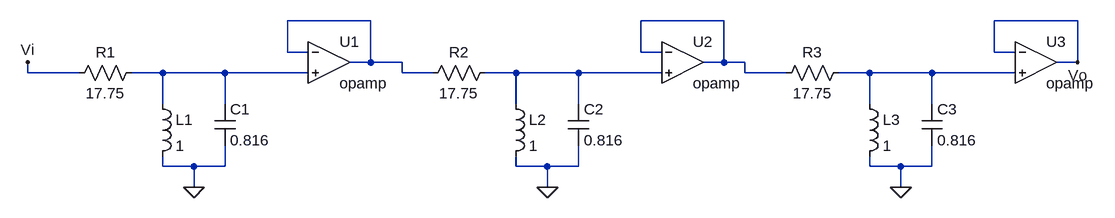
[diagram p0: schematic TS6.asc]
TS6.asc, the LTspice schematic file:
Version 4
SHEET 1 1540 680
WIRE 416 16 288 16
WIRE 960 16 832 16
WIRE 1504 16 1376 16
WIRE 288 64 288 16
WIRE 320 64 288 64
WIRE 832 64 832 16
WIRE 864 64 832 64
WIRE 1376 64 1376 16
WIRE 1408 64 1376 64
WIRE 416 80 416 16
WIRE 416 80 384 80
WIRE 464 80 416 80
WIRE 960 80 960 16
WIRE 960 80 928 80
WIRE 992 80 960 80
WIRE 1504 80 1504 16
WIRE 1504 80 1472 80
WIRE -112 96 -112 80
WIRE -32 96 -112 96
WIRE 96 96 48 96
WIRE 192 96 96 96
WIRE 320 96 192 96
WIRE 464 96 464 80
WIRE 512 96 464 96
WIRE 640 96 592 96
WIRE 736 96 640 96
WIRE 864 96 736 96
WIRE 992 96 992 80
WIRE 1056 96 992 96
WIRE 1184 96 1136 96
WIRE 1280 96 1184 96
WIRE 1408 96 1280 96
WIRE 96 144 96 96
WIRE 192 144 192 96
WIRE 640 144 640 96
WIRE 736 144 736 96
WIRE 1184 144 1184 96
WIRE 1280 144 1280 96
WIRE 96 240 96 224
WIRE 144 240 96 240
WIRE 192 240 192 208
WIRE 192 240 144 240
WIRE 640 240 640 224
WIRE 688 240 640 240
WIRE 736 240 736 208
WIRE 736 240 688 240
WIRE 1184 240 1184 224
WIRE 1232 240 1184 240
WIRE 1280 240 1280 208
WIRE 1280 240 1232 240
WIRE 144 272 144 240
WIRE 688 272 688 240
WIRE 1232 272 1232 240
FLAG -112 80 Vi
FLAG 144 272 0
FLAG 688 272 0
FLAG 1232 272 0
FLAG 1504 80 Vo
SYMBOL res 64 80 R90
WINDOW 0 0 56 VBottom 2
WINDOW 3 32 56 VTop 2
SYMATTR InstName R1
SYMATTR Value 17.75
SYMBOL ind 80 128 R0
SYMATTR InstName L1
SYMATTR Value 1
SYMBOL cap 176 144 R0
SYMATTR InstName C1
SYMATTR Value 0.816
SYMBOL Opamps\\opamp 352 16 R0
SYMATTR InstName U1
SYMBOL res 608 80 R90
WINDOW 0 0 56 VBottom 2
WINDOW 3 32 56 VTop 2
SYMATTR InstName R2
SYMATTR Value 17.75
SYMBOL ind 624 128 R0
SYMATTR InstName L2
SYMATTR Value 1
SYMBOL cap 720 144 R0
SYMATTR InstName C2
SYMATTR Value 0.816
SYMBOL Opamps\\opamp 896 16 R0
SYMATTR InstName U2
SYMBOL res 1152 80 R90
WINDOW 0 0 56 VBottom 2
WINDOW 3 32 56 VTop 2
SYMATTR InstName R3
SYMATTR Value 17.75
SYMBOL ind 1168 128 R0
SYMATTR InstName L3
SYMATTR Value 1
SYMBOL cap 1264 144 R0
SYMATTR InstName C3
SYMATTR Value 0.816
SYMBOL Opamps\\opamp 1440 16 R0
SYMATTR InstName U3

The netlist it stands for:
* TS6.asc
R1 N003 Vi 17.75
L1 N003 0 1
C1 N003 0 0.816
XU1 N001 N003 N001 opamp Aol=100K GBW=10Meg  ; pins invin noninvin out
R2 N004 N001 17.75
L2 N004 0 1
C2 N004 0 0.816
XU2 N002 N004 N002 opamp Aol=100K GBW=10Meg  ; pins invin noninvin out
R3 N005 N002 17.75
L3 N005 0 1
C3 N005 0 0.816
XU3 Vo N005 Vo opamp Aol=100K GBW=10Meg  ; pins invin noninvin out
.backanno
.end